# Altium schematic sheet nfc-epd-power.SchDoc
size A
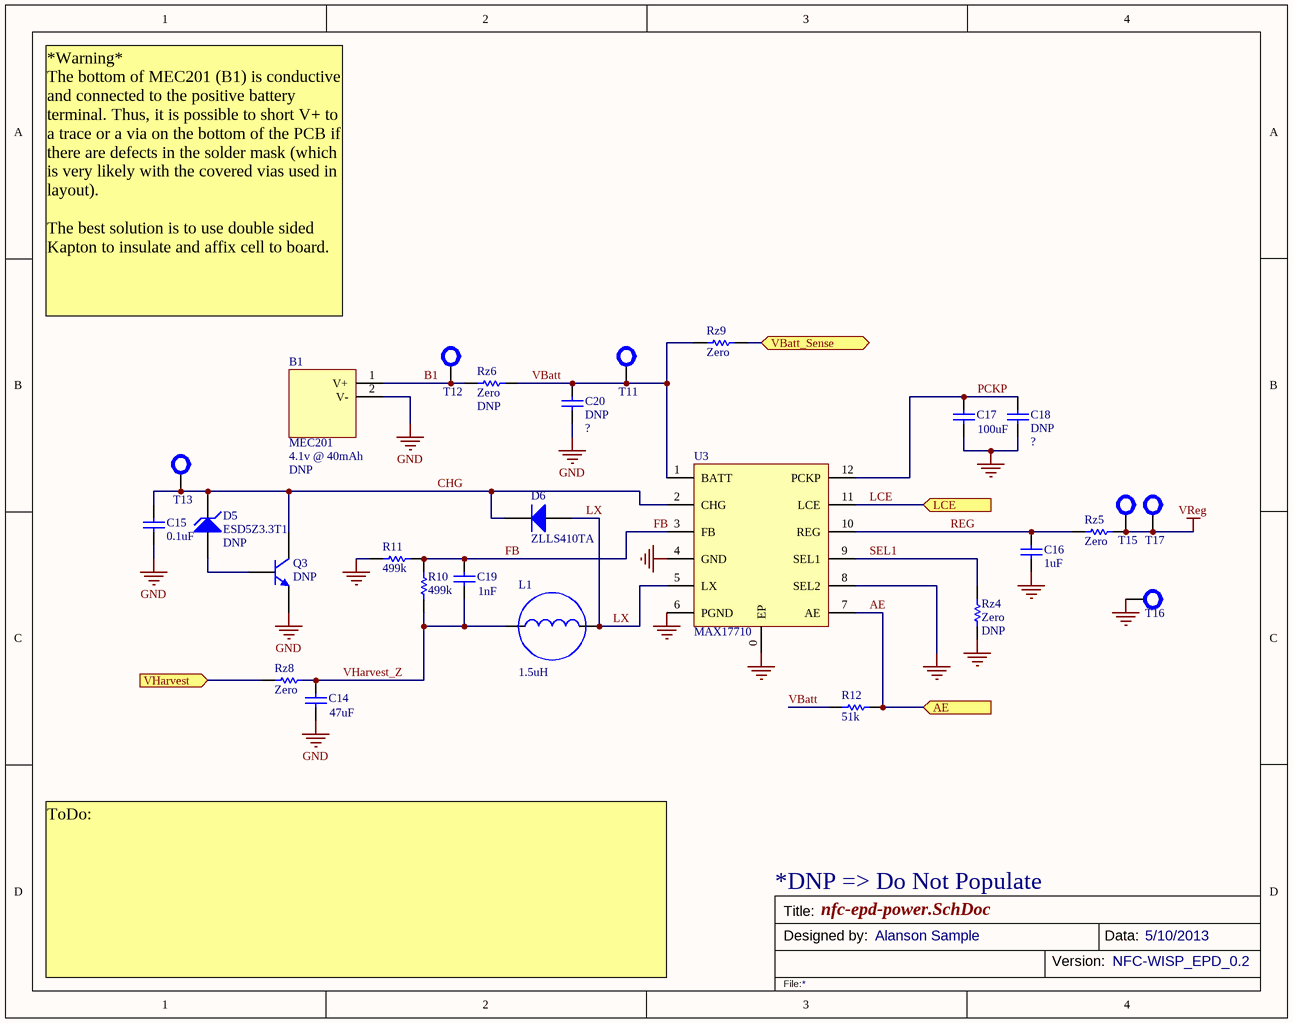
[diagram p0: nfc-epd-power.SchDoc]

## Parts
B1  MEC201  value 4.1v @ 40mAh  Note: DNP  [Battery - MEC201 - Caution]
C14  value 47uF  [0805]  (hidden comment: Cap)
C15  value 0.1uF  [0603]  (hidden comment: Cap)
C16  value 1uF  [0603]  (hidden comment: Cap)
C17  value 100uF  [1206]  (hidden comment: Cap)
C18  Note: DNP  [1206]  (hidden comment: Cap)
C19  value 1nF  [0603]  (hidden comment: Cap)
C20  Note: DNP  [1206]  (hidden comment: Cap)
D5  ESD5Z3.3T1  Note: DNP  [SOD-523]
D6  ZLLS410TA  [SOD-323]
L1  value 1.5uH  [Inductor - 1008]  (hidden comment: Ind - Power)
Q3  Note: DNP  [SOT-323 / SC-70]  (hidden comment: BJT - Generic)
R10  value 499k  [0603]  (hidden comment: Res)
R11  value 499k  [0603]  (hidden comment: Res)
R12  value 51k  [0603]  (hidden comment: Res)
Rz4  value Zero  Note: DNP  [0603]  (hidden comment: Res)
Rz5  value Zero  [0603]  (hidden comment: Res)
Rz6  value Zero  Note: DNP  [0603]  (hidden comment: Res)
Rz8  value Zero  [0603]  (hidden comment: Res)
Rz9  value Zero  [0603]  (hidden comment: Res)
T11  Test Point  [Test Point - Super Small]  (value not drawn)
T12  Test Point  [Test Point - Super Small]  (value not drawn)
T13  Test Point  [Test Point - Super Small]  (value not drawn)
T15  Test Point  [Test Point - Small]  (value not drawn)
T16  Test Point  [Test Point - Small]  (value not drawn)
T17  Test Point  [Test Point - Small]  (value not drawn)
U3  MAX17710  [MAX17710 - Wings]

## Ports
AE (in), LCE (in), VBatt_Sense, VHarvest (in)

## Nets
GND: B1.2(V-) C14.1 C15.2 C16.2 C17.1 C18.1 C20.2 Q3.2(E) R11.2 Rz4.2 T16.0 U3.0(EP) U3.4(GND) U3.6(PGND) U3.8(SEL2)
VReg: Rz5.2 T15.0 T17.0
AE: R12.2 U3.7(AE) ; port AE
B1: B1.1(V+) Rz6.2 T12.0
CHG: C15.1 D5.1(C) D6.2(C) Q3.3(C) T13.0 U3.2(CHG)
FB: C19.2 R10.2 R11.1 U3.3(FB)
LCE: U3.11(LCE) ; port LCE
LX: D6.1(A) L1.2 U3.5(LX)
PCKP: C17.2 C18.2 U3.12(PCKP)
REG: C16.1 Rz5.1 U3.10(REG)
SEL1: Rz4.1 U3.9(SEL1)
VBatt: C20.1 R12.1 Rz6.1 Rz9.1 T11.0 U3.1(BATT)
VBatt_Sense: Rz9.2 ; port VBatt_Sense
VHarvest: Rz8.1 ; port VHarvest
VHarvest_Z: C14.2 C19.1 L1.1 R10.1 Rz8.2
NetD5_2: D5.2(A) Q3.1(B)

## Notes on the sheet
- *Warning*
  The bottom of MEC201 (B1) is conductive and connected to the positive battery terminal. Thus, it is possible to short V+ to a trace or a via on the bottom of the PCB if there are defects in the solder mask (which is very likely with the covered vias used in layout).
  The best solution is to use double sided Kapton to insulate and affix cell to board.
- *DNP => Do Not Populate
- ToDo:
- Title:
- Designed by:
- Alanson Sample
- Version:
- Data:
- NFC-WISP_EPD_0.2
- 5/10/2013
- File:

## Library data of the parts
B1 = Battery - MEC201: ThinFilm solid state battery  - 4.1V 1.0MAH; Manufacturer Part Number: MEC201-10S (several in same formfactor); Manufacturer: Infinite Power Solutions; Rating: *R; Digi-Key Part Number: MEC201-10SCT-ND (several in same formfactor)
C14 C16-C19 = Cap: Ceramic Capacitor (Surface Mount); Manufacturer: Generic Ceramic Chip Cap (TBD); Rating: 6V; Digi-Key Part Number: *; Manufacturer Part Number: *
  C14 C16 C17 C19: Note: *
  C18: Value: ?
C15 C20 = Cap: Ceramic Capacitor (Surface Mount); Manufacturer: Generic Ceramic Chip Cap (TBD); Digi-Key Part Number: *; Manufacturer Part Number: *; Rating: *
  C15: Note: *
  C20: Value: ?
D5 = ESD5Z3.3T1: 5V Overvoltage Protection Zener; Manufacturer Part Number: ESD5Z3.3T1G; Manufacturer: ON Semiconductor; Digi-Key Part Number: ESD5Z3.3T1GOSCT-ND; Value: *; Rating: *
D6 = Diode: General Purpose Diode; Manufacturer: Diodes Inc; Manufacturer Part Number: ZLLS410TA; Digi-Key Part Number: ZLLS410CT-ND; Value: *; Rating: *; Note: *
L1 = Ind - Power: Power Inductor; Manufacturer: Murata Electronics North America; Manufacturer Part Number: LQM2HPN1R5MG0; Digi-Key Part Number: 490-5113-2-ND; Note: *; Rating: *
Q3 = BJT - Generic: Generic BJT; Digi-Key Part Number: *; Manufacturer: *; Manufacturer Part Number: *; Value: *; Rating: *
R10-R12 Rz4-Rz6 Rz8 Rz9 = Res: Chip Resistor (Surface Mount); Manufacturer: Generic Chip Res (TBD); Manufacturer Part Number: *; Digi-Key Part Number: *; Rating: *
  R10-R12: Note: *
T11-T13 T15-T17 = Test Point: Test Point, large or small foot prints; Manufacturer Part Number: Example: 5000, 5013; Manufacturer: Keystone Electronics; Note: *; Rating: *; Value: *
  T11-T13: Digi-Key Part Number: Example: 5000K-ND, 5012K-ND, Surface mount 5015KCT-ND
  T15-T17: Digi-key: Example: 5000K-ND, 5012K-ND
U3 = MAX17710: IC ENERGY HARVEST MNGR 12UTDFN; Manufacturer: Maxim Integrated; Manufacturer Part Number: MAX17710G+T; Digi-Key Part Number: MAX17710G+TCT-ND; Note: *; Value: *; Rating: *